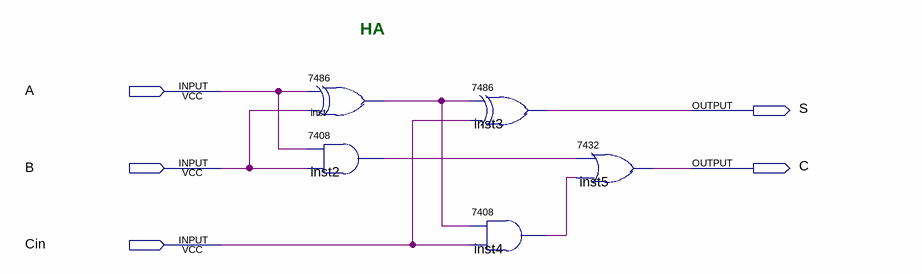
[diagram p0: schematic sheet]
// Quartus schematic FA.bdf as structural Verilog: 5 symbols, 5 pins
module FA (
  input  A,
  input  B,
  input  Cin,
  output S,
  output C
);

  wire inst2_1, inst4_1, inst_1;

  \7486  inst (.\2 (A), .\3 (B), .\1 (inst_1));
  \7408  inst2 (.\3 (B), .\2 (A), .\1 (inst2_1));
  \7486  inst3 (.\2 (inst_1), .\3 (Cin), .\1 (S));
  \7408  inst4 (.\3 (Cin), .\2 (inst_1), .\1 (inst4_1));
  \7432  inst5 (.\2 (inst2_1), .\3 (inst4_1), .\1 (C));

  // Notes on the sheet:
  //   HA
endmodule
